# EAGLE design nrf24l01 (EAGLE 9.5.1)
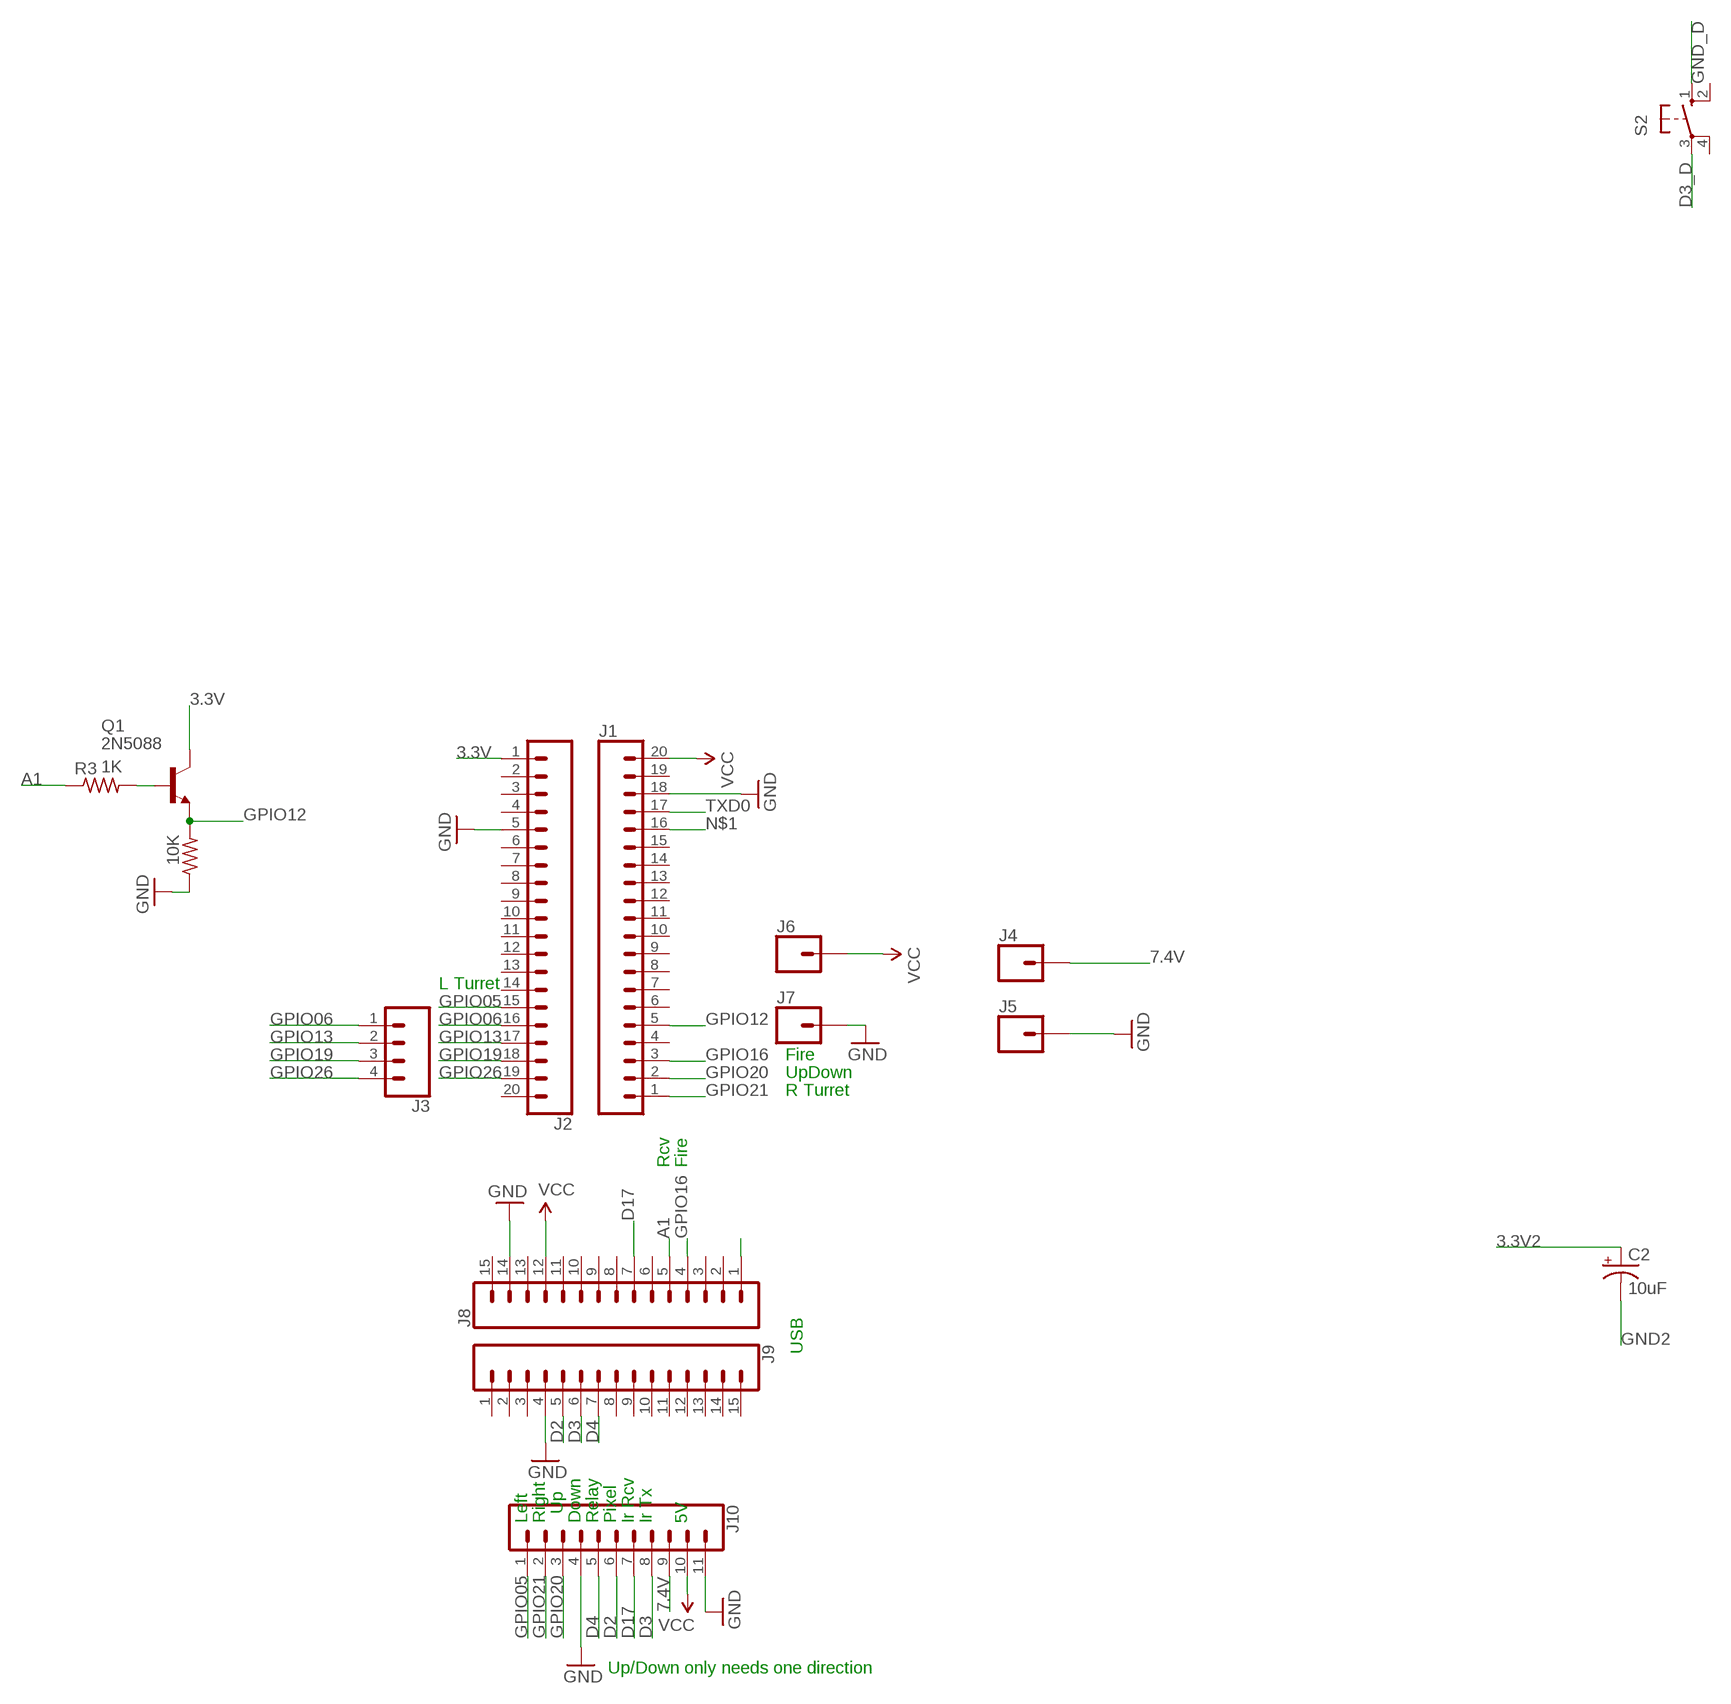
[diagram p0: schematic, sheet 1]

## Parts
10K  10K  R-US_0207/12  [0207/12]
C2  10uF  10UF-POLAR-RADIAL-2.5MM-25V-20%  [CPOL-RADIAL-2.5MM-5MM]
J1  CONN_20  [1X20]
J2  CONN_20  [1X20]
J3  CONN_04  [1X04]
J4  CONN_01  [1X01]
J5  CONN_01  [1X01]
J6  CONN_01  [1X01]
J7  CONN_01  [1X01]
J8  CONN_15  [1X15]
J9  CONN_15  [1X15]
J10  CONN_11  [1X11]
Q1  2N5088  [TO92]
R3  1K  R-US_0207/12  [0207/12]
S2  40-XX  [B3F-40XX]

## Nets
3.3V: J2.1 Q1.1(C)
3.3V2: C2.1(+)
7.4V: J4.1 J10.9
A1: J8.5 R3.1
D2: J9.5 J10.6
D3: J9.6 J10.8
D3_D: S2.3(P)
D4: J9.7 J10.5
D17: J8.7 J10.7
GND [gnd]: 10K.1 J1.18 J2.5 J5.1 J7.1 J8.14 J9.4 J10.4 J10.11
GND2: C2.2(-)
GND_D: S2.1(S)
GPIO05: J2.15 J10.1
GPIO06: J2.16 J3.1
GPIO12: 10K.2 J1.5 Q1.3(E)
GPIO13: J2.17 J3.2
GPIO16: J1.3 J8.4
GPIO19: J2.18 J3.3
GPIO20: J1.2 J10.3
GPIO21: J1.1 J10.2
GPIO26: J2.19 J3.4
N$1: J1.16
N$2: J8.1
N$4: Q1.2(B) R3.2
TXD0: J1.17
VCC: J1.20 J6.1 J8.12 J10.10
Unconnected: J1.4 J1.6 J1.7 J1.8 J1.9 J1.10 J1.11 J1.12 J1.13 J1.14 J1.15 J1.19 J2.2 J2.3 J2.4 J2.6 J2.7 J2.8 J2.9 J2.10 J2.11 J2.12 J2.13 J2.14 J2.20 J8.2 J8.3 J8.6 J8.8 J8.9 J8.10 J8.11 J8.13 J8.15 J9.1 J9.2 J9.3 J9.8 J9.9 J9.10 J9.11 J9.12 J9.13 J9.14 J9.15 S2.2(S1) S2.4(P1)

## Notes on the sheet
- L Turret
- Fire
- UpDown
- R Turret
- Rcv | Fire
- USB
- Up
- Left | Right | Down | Relay | Pixel | Ir Rcv | Ir Tx | 5V
- Up/Down only needs one direction

## Library data of the parts
10K R3 = resistor:R-US_: RESISTOR, American symbol
C2 = SparkFun-Capacitors:10UF-POLAR: 10.0µF polarized capacitors A capacitor is a passive two-terminal electrical component used to store electrical energy temporarily in an electric field.; PROD_ID: CAP-08440
J1 J2 = SparkFun-Connectors:CONN_20: Multi connection point. Often used as Generic Header-pin footprint for 0.1 inch spaced/style header connections On any of the 0.1 inch spaced packages, you can populate with these: Break Away Headers - Straight <https://www.sparkfun.com/products/116> (PRT-00116) Break Away Male Headers - Right Angle <https://www.sparkfun.com/products/553> (PRT-00553) Female Headers <https://www.sparkfun.com/products/115> (PRT-00115) Break Away Headers - Machine Pin <https://www.sparkfun.com/products/117> (PRT-00117) Break Away Female Headers - Swiss Machine Pin <https://www.sparkfun.com/products/743> (PRT-00743) For SCREWTERMINALS and SPRING TERMINALS visit here: Screw Terimnals on SparkFun.com <https://www.sparkfun.com/search/results?term=Screw+Terminals> (5mm/3.5mm/2.54mm spacing) This device is also useful as a general connection point to wire up your design to another part of your project. Our various solder wires solder well into these plated through hole pads. Hook-Up Wire - Assortment (Stranded, 22 AWG) <https://www.sparkfun.com/products/11375> (PRT-11375) Hook-Up Wire - Assortment (Solid Core, 22 AWG) <https://www.sparkfun.com/products/11367> (PRT-11367) View the entire wire category on our website here <https://www.sparkfun.com/categories/141> Special notes: Molex polarized connector foot print use with SKU : PRT-08231 with associated crimp pins and housings. 1MM SMD Version SKU: PRT-10208 NOTES ON THE VARIANTS LOCK and LOCK_LONGPADS... This footprint was designed to help hold the alignment of a through-hole component (i.e. 6-pin header) while soldering it into place. You may notice that each hole has been shifted either up or down by 0.005 of an inch from it's more standard position (which is a perfectly straight line). This slight alteration caused the pins (the squares in the middle) to touch the edges of the holes. Because they are alternating, it causes a "brace" to hold the component in place. 0.005 has proven to be the perfect amount of "off-center" position when using our standard breakaway headers. Although looks a little odd when you look at the bare footprint, once you have a header in there, the alteration is very hard to notice. Also,if you push a header all the way into place, it is covered up entirely on the bottom side. Note about LOCK SPECIAL package: This is just like the LOCK variant in that the holes are staggared by 5 mil, but except for the last two holes. They are not altered from the "standard" footprint layout. This is used for a special purpose on the layout of our Graphic LCD Backpack. Make sure you want to use this device before selecting it for you project!
J3 = SparkFun-Connectors:CONN_04: Multi connection point. Often used as Generic Header-pin footprint for 0.1 inch spaced/style header connections On any of the 0.1 inch spaced packages, you can populate with these: Break Away Headers - Straight <https://www.sparkfun.com/products/116> (PRT-00116) Break Away Male Headers - Right Angle <https://www.sparkfun.com/products/553> (PRT-00553) Female Headers <https://www.sparkfun.com/products/115> (PRT-00115) Break Away Headers - Machine Pin <https://www.sparkfun.com/products/117> (PRT-00117) Break Away Female Headers - Swiss Machine Pin <https://www.sparkfun.com/products/743> (PRT-00743) For SCREWTERMINALS and SPRING TERMINALS visit here: Screw Terimnals on SparkFun.com <https://www.sparkfun.com/search/results?term=Screw+Terminals> (5mm/3.5mm/2.54mm spacing) This device is also useful as a general connection point to wire up your design to another part of your project. Our various solder wires solder well into these plated through hole pads. Hook-Up Wire - Assortment (Stranded, 22 AWG) <https://www.sparkfun.com/products/11375> (PRT-11375) Hook-Up Wire - Assortment (Solid Core, 22 AWG) <https://www.sparkfun.com/products/11367> (PRT-11367) View the entire wire category on our website here <https://www.sparkfun.com/categories/141> Special notes: Molex polarized connector foot print use with SKU : PRT-08231 with associated crimp pins and housings. 1MM SMD Version SKU: PRT-10208; PROD_ID: CONN-09696
J4-J7 = SparkFun-Connectors:CONN_01: Single connection point. Often used as Generic Header-pin footprint for 0.1 inch spaced/style header connections On any of the 0.1 inch spaced packages, you can populate with these: Break Away Headers - Straight <https://www.sparkfun.com/products/116> (PRT-00116) Break Away Male Headers - Right Angle <https://www.sparkfun.com/products/553> (PRT-00553) Female Headers <https://www.sparkfun.com/products/115> (PRT-00115) Break Away Headers - Machine Pin <https://www.sparkfun.com/products/117> (PRT-00117) Break Away Female Headers - Swiss Machine Pin <https://www.sparkfun.com/products/743> (PRT-00743) This device is also useful as a general connection point to wire up your design to another part of your project. Our various solder wires solder well into these plated through hole pads. Hook-Up Wire - Assortment (Stranded, 22 AWG) <https://www.sparkfun.com/products/11375> (PRT-11375) Hook-Up Wire - Assortment (Solid Core, 22 AWG) <https://www.sparkfun.com/products/11367> (PRT-11367) View the entire wire category on our website here <https://www.sparkfun.com/categories/141> Special notes: SMTSO-256-ET is a "flush mount" nut for a 4-40 screw. We mostly use this on specialty testbeds; it is a nice way to connect hardware to your PCB at an adjustable hieght. Also note, the SNAP packages are for using a snappable style connector. We sell a baggie of snaps and they are also used on two LilyPad designs: Snap Assortment - 30 pack (male and female) <https://www.sparkfun.com/products/11347> (DEV-11347) LilyPad Arduino SimpleSnap <https://www.sparkfun.com/products/10941> (DEV-10941) LilyPad SimpleSnap Protoboard <https://www.sparkfun.com/products/10940> (DEV-10940)
J8 J9 = SparkFun-Connectors:CONN_15: Multi connection point. Often used as Generic Header-pin footprint for 0.1 inch spaced/style header connections On any of the 0.1 inch spaced packages, you can populate with these: Break Away Headers - Straight <https://www.sparkfun.com/products/116> (PRT-00116) Break Away Male Headers - Right Angle <https://www.sparkfun.com/products/553> (PRT-00553) Female Headers <https://www.sparkfun.com/products/115> (PRT-00115) Break Away Headers - Machine Pin <https://www.sparkfun.com/products/117> (PRT-00117) Break Away Female Headers - Swiss Machine Pin <https://www.sparkfun.com/products/743> (PRT-00743) For SCREWTERMINALS and SPRING TERMINALS visit here: Screw Terimnals on SparkFun.com <https://www.sparkfun.com/search/results?term=Screw+Terminals> (5mm/3.5mm/2.54mm spacing) This device is also useful as a general connection point to wire up your design to another part of your project. Our various solder wires solder well into these plated through hole pads. Hook-Up Wire - Assortment (Stranded, 22 AWG) <https://www.sparkfun.com/products/11375> (PRT-11375) Hook-Up Wire - Assortment (Solid Core, 22 AWG) <https://www.sparkfun.com/products/11367> (PRT-11367) View the entire wire category on our website here <https://www.sparkfun.com/categories/141> Special notes: Molex polarized connector foot print use with SKU : PRT-08231 with associated crimp pins and housings. 1MM SMD Version SKU: PRT-10208 NOTES ON THE VARIANTS LOCK and LOCK_LONGPADS... This footprint was designed to help hold the alignment of a through-hole component (i.e. 6-pin header) while soldering it into place. You may notice that each hole has been shifted either up or down by 0.005 of an inch from it's more standard position (which is a perfectly straight line). This slight alteration caused the pins (the squares in the middle) to touch the edges of the holes. Because they are alternating, it causes a "brace" to hold the component in place. 0.005 has proven to be the perfect amount of "off-center" position when using our standard breakaway headers. Although looks a little odd when you look at the bare footprint, once you have a header in there, the alteration is very hard to notice. Also,if you push a header all the way into place, it is covered up entirely on the bottom side.
J10 = SparkFun-Connectors:CONN_11: Multi connection point. Often used as Generic Header-pin footprint for 0.1 inch spaced/style header connections On any of the 0.1 inch spaced packages, you can populate with these: Break Away Headers - Straight <https://www.sparkfun.com/products/116> (PRT-00116) Break Away Male Headers - Right Angle <https://www.sparkfun.com/products/553> (PRT-00553) Female Headers <https://www.sparkfun.com/products/115> (PRT-00115) Break Away Headers - Machine Pin <https://www.sparkfun.com/products/117> (PRT-00117) Break Away Female Headers - Swiss Machine Pin <https://www.sparkfun.com/products/743> (PRT-00743) For SCREWTERMINALS and SPRING TERMINALS visit here: Screw Terimnals on SparkFun.com <https://www.sparkfun.com/search/results?term=Screw+Terminals> (5mm/3.5mm/2.54mm spacing) This device is also useful as a general connection point to wire up your design to another part of your project. Our various solder wires solder well into these plated through hole pads. Hook-Up Wire - Assortment (Stranded, 22 AWG) <https://www.sparkfun.com/products/11375> (PRT-11375) Hook-Up Wire - Assortment (Solid Core, 22 AWG) <https://www.sparkfun.com/products/11367> (PRT-11367) View the entire wire category on our website here <https://www.sparkfun.com/categories/141>
Q1 = transistor-npn:2N5088: NPN Transistor
S2 = switch-omron:40-XX: OMRON SWITCH; MF: OMRON COMPONENTS USA; MPN: B3F-4000; OC_FARNELL: 176434; OC_NEWARK: 36K3105

## Net classes
0 default: width 0.254 mm, clearance 0.254 mm
1 power: width 0.61 mm, drill 0.711 mm, clearance 0.33 mm
2 gnd: width 0.305 mm, drill 0.711 mm, clearance 0.254 mm
3 usbvcc: width 0.508 mm, drill 0.711 mm, clearance 0.254 mm
4 aref: width 0.406 mm

## Board
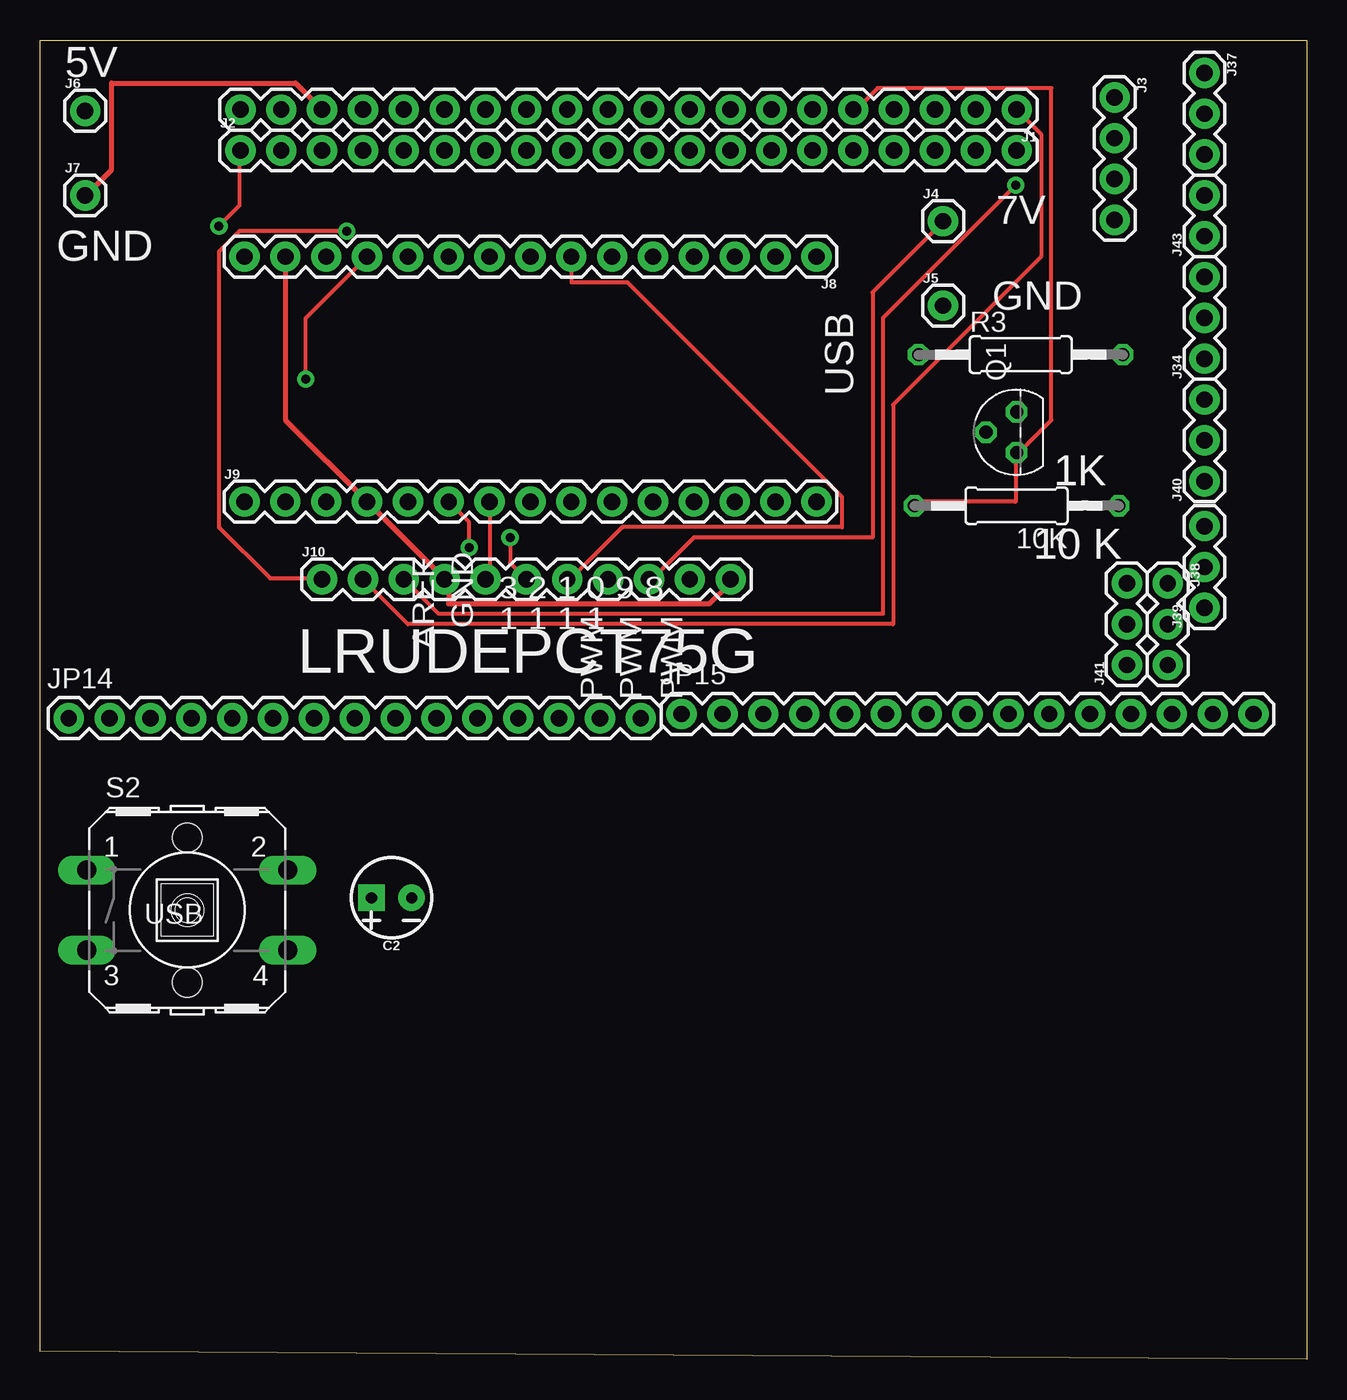
[diagram p1: board, top side]
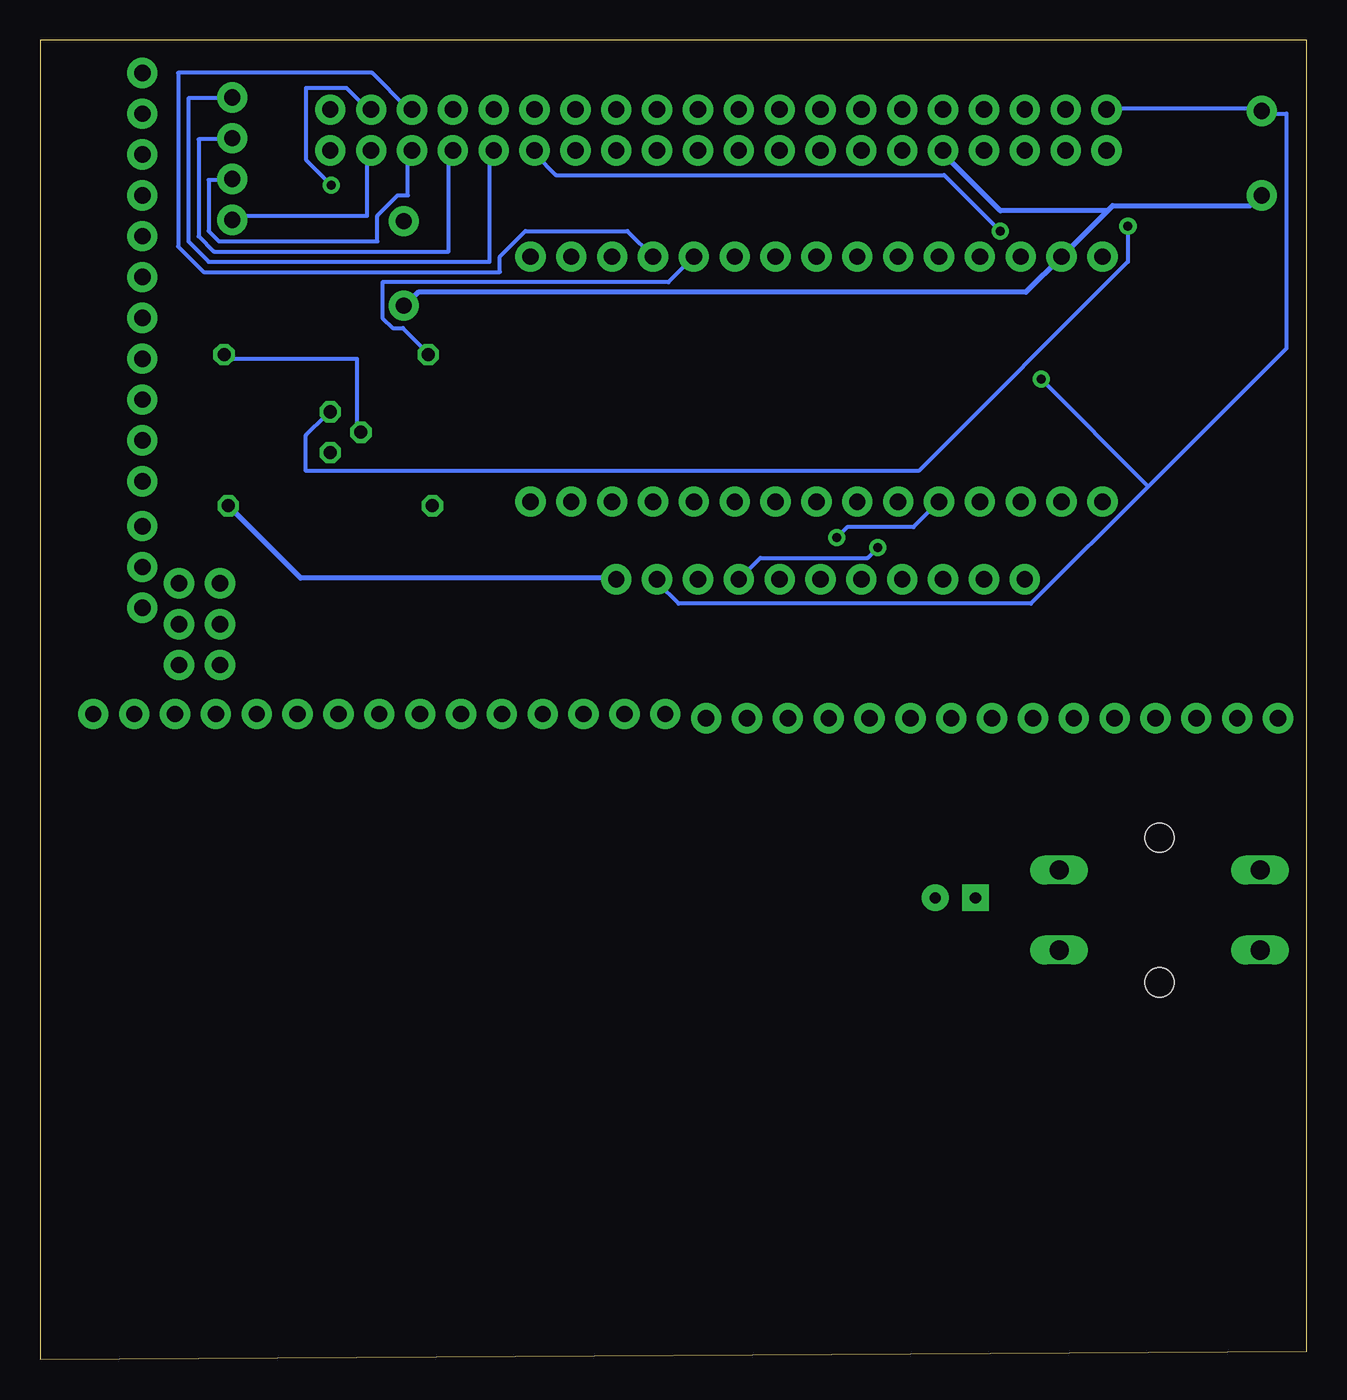
[diagram p2: board, bottom side, seen from below]

Size 78.74 x 82.04 mm. Coordinates in mm from the lower left corner, seen from the top.
Outline: 0,82.04 78.74,82.04 78.74,0 0,0.51 0,82.04
Copper layers (1*16): Top 0.035mm / dielectric 1.5mm / Bottom 0.035mm
Design rules "default": minimum track width 10mil, minimum drill 22mil, track to track 10mil, track to pad 10mil, pad to pad 10mil, via to via 16mil, smd to smd 8mil, copper to edge 30mil, drill to drill 12mil, minimum pad ring 10mil, minimum via ring 10mil, stop-mask expansion 4mil, vias tented up to drill 0mil, thermal gap 10mil
vRestrict: area 25.4,45.5 to 27.1,49.1; area 33.4,41 to 34.9,44.6; area 35.9,41 to 37.5,44.6; area 38.5,41 to 40,44.6; area 42.5,38.6 to 43.1,38.9

### Footprints (pad centres in the part's own frame; a part is rotated, then mirrored left to right if it is on the bottom)
0207/12 = drill 0.813 octagon: 1 -6.35,0; 2 6.35,0
CPOL-RADIAL-2.5MM-5MM = drill 0.7 pad 1.651 square: 1 1.25,0 | drill 0.7 pad 1.651: 2 -1.25,0
1X20 = drill 1.016 pad 1.88: 1 0,0; 2 2.54,0; 3 5.08,0; 4 7.62,0; 5 10.16,0; 6 12.7,0; 7 15.24,0; 8 17.78,0; 9 20.32,0; 10 22.86,0; 11 25.4,0; 12 27.94,0; 13 30.48,0; 14 33.02,0; 15 35.56,0; 16 38.1,0; 17 40.64,0; 18 43.18,0; 19 45.72,0; 20 48.26,0
1X04 = drill 1.016 pad 1.88: 1 0,0; 2 2.54,0; 3 5.08,0; 4 7.62,0
1X01 = drill 1.016 pad 1.88: 1 0,0
1X15 = drill 1.016 pad 1.88: 1 0,0; 2 2.54,0; 3 5.08,0; 4 7.62,0; 5 10.16,0; 6 12.7,0; 7 15.24,0; 8 17.78,0; 9 20.32,0; 10 22.86,0; 11 25.4,0; 12 27.94,0; 13 30.48,0; 14 33.02,0; 15 35.56,0
1X11 = drill 1.016 pad 1.88: 1 0,0; 2 2.54,0; 3 5.08,0; 4 7.62,0; 5 10.16,0; 6 12.7,0; 7 15.24,0; 8 17.78,0; 9 20.32,0; 10 22.86,0; 11 25.4,0
1X03 = drill 1.016 pad 1.88: 1 0,0; 2 2.54,0; 3 5.08,0
1X02 = drill 1.016 pad 1.88: 1 0,0; 2 2.54,0
TO92 = drill 0.813 octagon: 1 1.27,0; 2 0,1.905; 3 -1.27,0
B3F-40XX = drill 1.194 long: 1 -6.248,2.489; 2 6.248,2.489; 3 -6.248,-2.489; 4 6.248,-2.489 | hole 1.803: 0,-4.496; 0,4.496

### Placement (x,y rotation side)
10K  60.71,53.09 180 top
C2  21.84,28.7 180 top
J1  60.71,77.72 180 top
J2  12.45,75.18 0 top
J3  66.8,78.49 270 top
J4  56.13,70.79 0 top
J5  56.13,65.53 0 top
J6  2.79,77.65 0 top
J7  2.79,72.39 0 top
J8  48.26,68.58 180 top
J9  12.7,53.34 0 top
J10  17.53,48.51 0 top
J34  [1X03]  72.39,62.23 90 top
J37  [1X03]  72.39,80.01 270 top
J38  [1X03]  70.1,48.26 270 top
J39  [1X03]  72.39,46.74 90 top
J40  [1X03]  72.39,54.61 90 top
J41  [1X03]  67.56,43.18 90 top
J43  [1X02]  72.39,69.85 90 top
JP14  [1X15]  1.78,39.88 0 top
JP15  [1X15]  39.88,40.13 0 top
Q1  60.71,57.66 90 top
R3  60.96,62.48 0 top
S2  9.14,27.94 0 top

### Tracks (layer width: path | path; a pad name or v marks a point on that pad's centre or on a via)
3.3V  (via drill 0.56)
  Top 0.254: v11.11,70.48 12.38,71.75 12.38,74.93 J2.1
  Bottom 0.254: v11.11,70.48 11.11,68.26 24.13,55.24 62.23,55.24 62.23,57.47 60.96,58.74 Q1.1
7.4V
  Top 0.254: J10.9 38.1,48.58 40.64,51.12 51.75,51.12 51.75,66.36 55.88,70.48 J4.1
A1
  Bottom 0.254: J8.5 39.69,66.99 57.47,66.99 57.47,64.77 56.83,64.14 56.2,64.14 54.61,62.55 R3.1
D2  (via drill 0.56)
  Top 0.254: J10.6 29.21,49.53 v29.21,51.12
  Bottom 0.254: v29.21,51.12 28.57,51.75 24.45,51.75 J9.5
D3  (via drill 0.56)
  Top 0.254: J9.6 26.67,52.07 v26.67,50.48
  Bottom 0.254: v26.67,50.48 27.3,49.85 33.97,49.85 J10.8
D4
  Top 0.254: J9.7 27.94,48.58 J10.5
D17
  Top 0.254: J8.7 33.02,66.99 36.51,66.99 49.85,53.66 49.85,51.75 36.2,51.75 33.02,48.58 J10.7
GND
  Top 0.305: J1.18 15.88,79.38 4.45,79.38 4.45,73.98 2.86,72.39 J7.1 | J8.14 15.24,58.42 J9.4 J10.4 25.4,48.26 25.4,46.99 41.59,46.99 42.86,48.26 J10.11
  Bottom 0.305: 10K.1 62.55,48.58 43.18,48.58 J10.11 | 12.38,71.44 J8.14 17.46,66.36 55.24,66.36 55.88,65.72 J5.1 | 12.38,71.44 12.06,71.75 3.49,71.75 2.86,72.39 J7.1 | 12.38,71.44 19.05,71.44 22.54,74.93 J2.5
GPIO05  (via drill 0.56)
  Top 0.254: v19.05,70.17 12.38,70.17 11.11,68.9 11.11,51.75 14.29,48.58 17.46,48.58 J10.1
  Bottom 0.254: v19.05,70.17 22.54,73.66 46.67,73.66 47.94,74.93 J2.15
GPIO06
  Bottom 0.254: J2.16 50.8,74.93 50.8,68.26 68.26,68.26 69.53,69.53 69.53,78.42 66.99,78.42 J3.1
GPIO12
  Top 0.254: 10K.2 54.61,53.34 60.64,53.34 60.64,56.2 Q1.3 60.96,56.52 62.87,58.42 62.87,79.06 52.07,79.06 50.8,77.79 J1.5
GPIO13
  Bottom 0.254: J2.17 53.34,74.93 53.34,68.9 67.94,68.9 68.9,69.85 68.9,75.88 66.99,75.88 J3.2
GPIO16
  Bottom 0.254: J8.4 42.23,70.17 48.58,70.17 50.16,68.58 50.16,67.63 68.58,67.63 70.17,69.22 70.17,80.01 58.1,80.01 55.88,77.79 J1.3
GPIO19
  Bottom 0.254: J2.18 55.88,74.93 55.88,72.39 56.52,72.39 57.78,71.12 57.78,69.53 67.63,69.53 68.26,70.17 68.26,73.34 66.99,73.34 J3.3
GPIO20  (via drill 0.56)
  Top 0.254: J10.3 24.77,46.35 52.39,46.35 52.39,64.77 v60.64,73.03
  Bottom 0.254: v60.64,73.03 62.23,74.61 62.23,79.06 59.69,79.06 58.42,77.79 J1.2
GPIO21
  Top 0.254: J10.2 22.86,45.72 53.02,45.72 53.02,59.37 62.23,68.58 62.23,76.2 J1.1
GPIO26
  Bottom 0.254: J2.19 58.42,74.93 58.42,71.12 66.67,71.12 J3.4
N$4
  Bottom 0.254: Q1.2 59.05,57.78 59.05,62.23 67.31,62.23 R3.2
VCC  (via drill 0.56)
  Top 0.254: J8.12 16.51,64.77 v16.51,60.96
  Bottom 0.254: 9.84,54.29 1.27,62.87 1.27,77.47 2.54,77.47 J6.1 2.86,77.79 12.38,77.79 J1.20 | 9.84,54.29 17.14,46.99 39.05,46.99 40.32,48.26 J10.10 | 9.84,54.29 v16.51,60.96

### Text on the board
tNames: 3 2 1 0 9 8 | GND | 1 1 1 1 | AREF | PWM | PWM | PWM | USB
Reference: C8 | C2 | R11 | C4 | C5
_tsilk: 5V | 7V | GND | GND | USB | 1K | 10 K | LRUDEPCT75G